# Altium project AD637均方根值检测.PrjPcb
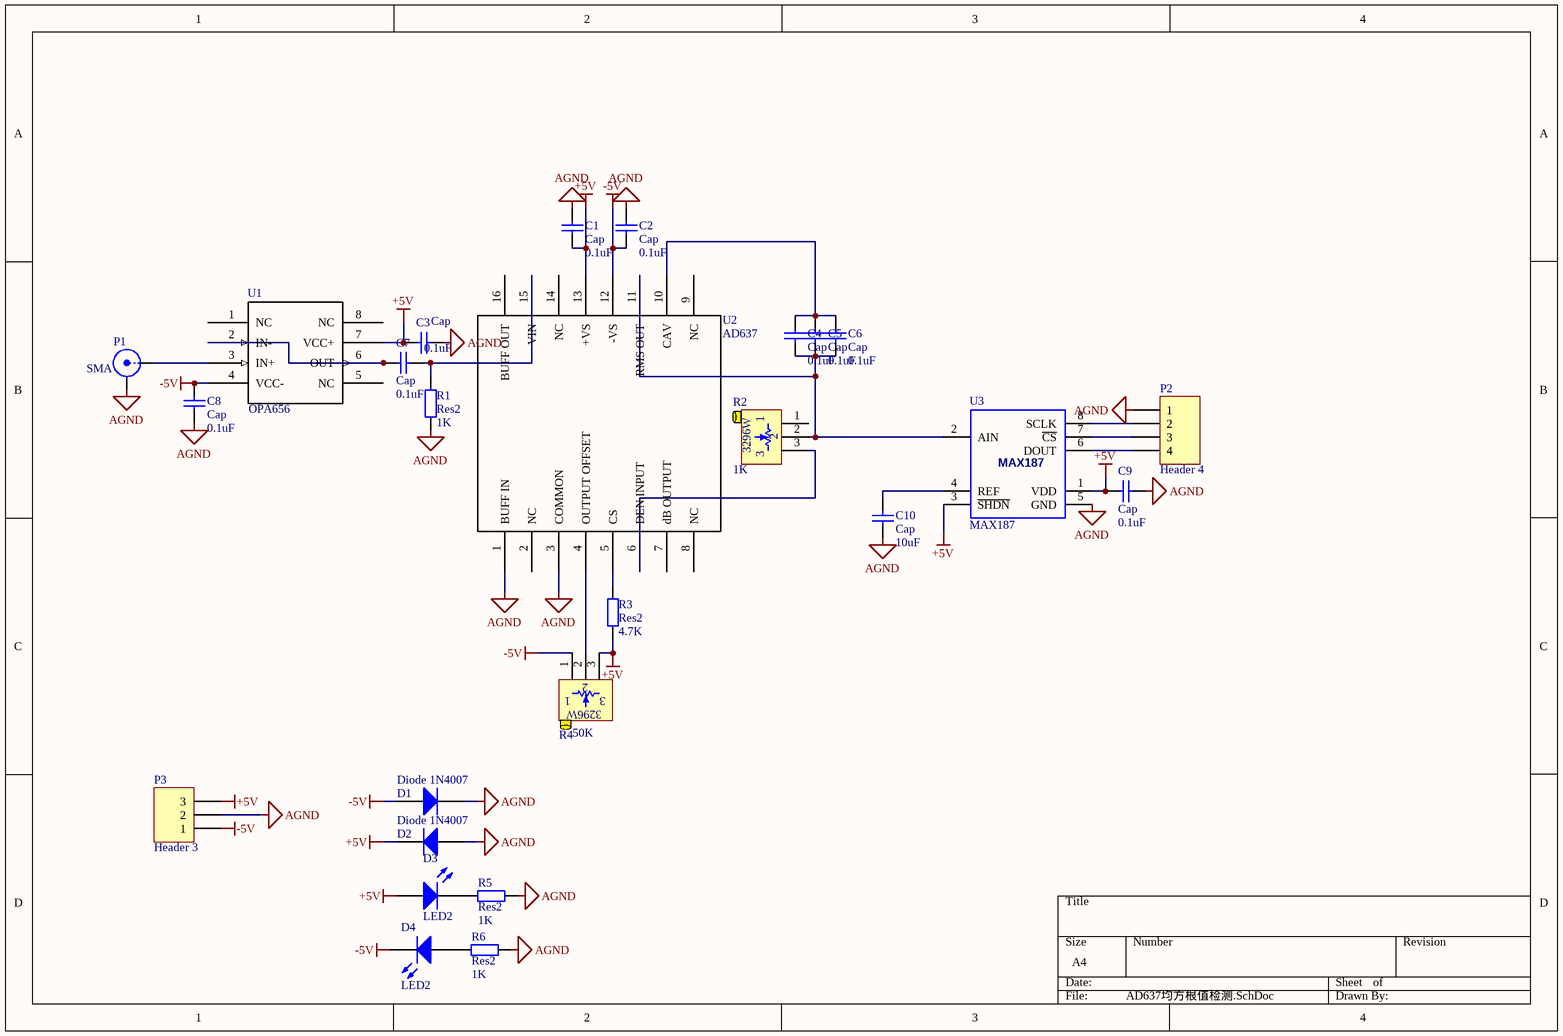
[diagram p0: AD637均方根值检测.SchDoc]
1 sheet, 26 parts. Net scope: global (net labels, ports and power ports of the same name join across sheets).
Board files: AD637均方根值检测.PcbDoc, AD637均方根值检测_print.PcbDoc

## Sheet AD637均方根值检测.SchDoc
size A4

### Parts
C1  Cap  value 0.1uF  [0805]
C2  Cap  value 0.1uF  [0805]
C3  Cap  value 0.1uF  [0805]
C4  Cap  value 0.1uF  [0805]
C5  Cap  value 0.1uF  [0805]
C6  Cap  value 0.1uF  [0805]
C7  Cap  value 0.1uF  [0805]
C8  Cap  value 0.1uF  [0805]
C9  Cap  value 0.1uF  [0805]
C10  Cap  value 10uF  [0805]
D1  Diode 1N4007  [0805]
D2  Diode 1N4007  [0805]
D3  LED2  [3.2X1.6X1.1]
D4  LED2  [3.2X1.6X1.1]
P1  SMA  [SMA]
P2  Header 4  [HDR1X4]
P3  Header 3  [3P排针]
R1  Res2  value 1K  [0805]
R2  1K  [3P排针]
R3  Res2  value 4.7K  [0805]
R4  50K  [3P排针]
R5  Res2  value 1K  [0805]
R6  Res2  value 1K  [0805]
U1  OPA656  [THS3001_SOIC]
U2  AD637  [AD637_SOIC]
U3  MAX187  [DIP8]

### Nets
+5V: C1.2 C3.1 C9.1 D2.2(K) D3.1(A) P3.3 R3.2 R4.3 U1.7(VCC+) U2.13(+VS) U3.1(VDD) U3.3(~{SHDN})
-5V: C2.2 C8.1 D1.1(A) D4.2(K) P3.1 R4.1 U1.4(VCC-) U2.12(-VS)
AGND: C1.1 C2.1 C3.2 C8.2 C9.2 C10.1 D1.2(K) D2.1(A) P1.2(Y) P2.1 P3.2 R1.1 R5.2 R6.2 U2.1(BUFF_IN) U2.3(COMMON) U3.5(GND)
NetC4_1: C4.1 C5.1 C6.1 R2.2 U2.11(RMS_OUT) U3.2(AIN)
NetC4_2: C4.2 C5.2 C6.2 U2.10(CAV)
NetC7_1: C7.1 U1.2(IN-) U1.6(OUT)
NetC7_2: C7.2 R1.2 U2.15(VIN)
NetC10_2: C10.2 U3.4(REF)
NetD3_2: D3.2(K) R5.1
NetD4_1: D4.1(A) R6.1
NetP1_1: P1.1(X) U1.3(IN+)
NetP2_2: P2.2 U3.8(SCLK)
NetP2_3: P2.3 U3.7(~{CS})
NetP2_4: P2.4 U3.6(DOUT)
NetR2_3: R2.3 U2.6(DEN_INPUT)
NetR3_1: R3.1 U2.5(CS)
NetR4_2: R4.2 U2.4(OUTPUT_OFFSET)

Not connected (* = marked no-connect by the designer): R2 1; U1 1(NC) 5(NC) 8(NC); U2 2(NC) 7(dB_OUTPUT) 8(NC) 9(NC) 14(NC) 16(BUFF_OUT)

### Notes on the sheet
- (in symbol 电位器_3296W) 3296W

### Library data of the parts
C1-C10 = Cap: Capacitor; Published: 8-Jun-2000; LatestRevisionDate: 17-Jul-2002; LatestRevisionNote: Re-released for DXP Platform.; PackageReference: RAD-0.3; Publisher: Altium Limited
D1 D2 = Diode 1N4007: 1 Amp General Purpose Rectifier; Published: 8-Jun-2000; LatestRevisionDate: 17-Jul-2002; LatestRevisionNote: Re-released for DXP Platform.; DatasheetDocument: 1998; PackageDocument: Aug-1999; PackageReference: DO-41; Publisher: Altium Limited; Code_JEDEC: DO-204-AL; ComponentLink1Description: Manufacturer Link; ComponentLink1URL: http://www.fairchildsemi.com/; ComponentLink2Description: Datasheet; ComponentLink2URL: http://www.fairchildsemi.com/ds/1N%2F1N4001.pdf
D3 D4 = LED2: Typical RED, GREEN, YELLOW, AMBER GaAs LED; Published: 8-Jun-2000; LatestRevisionDate: 17-Jul-2002; LatestRevisionNote: Re-released for DXP Platform.; PackageDocument: Feb-2002; PackageReference: 3.2X1.6X1.1; Publisher: Altium Limited
P2 = Header 4: Header, 4-Pin; LatestRevisionDate: 17-Jul-2002; LatestRevisionNote: Re-released for DXP Platform.; Publisher: Altium Limited
P3 = Header 3: Header, 3-Pin; LatestRevisionDate: 17-Jul-2002; LatestRevisionNote: Re-released for DXP Platform.; Publisher: Altium Limited
R1 R3 R5 R6 = Res2: Resistor; Published: 8-Jun-2000; LatestRevisionDate: 17-Jul-2002; LatestRevisionNote: Re-released for DXP Platform.; PackageReference: AXIAL-0.4; Publisher: Altium Limited
R2 R4 = 电位器_3296W
U3 = MAX187: +5V、低功耗、12位串行ADC